# EAGLE design DAC (EAGLE 9.1.3)
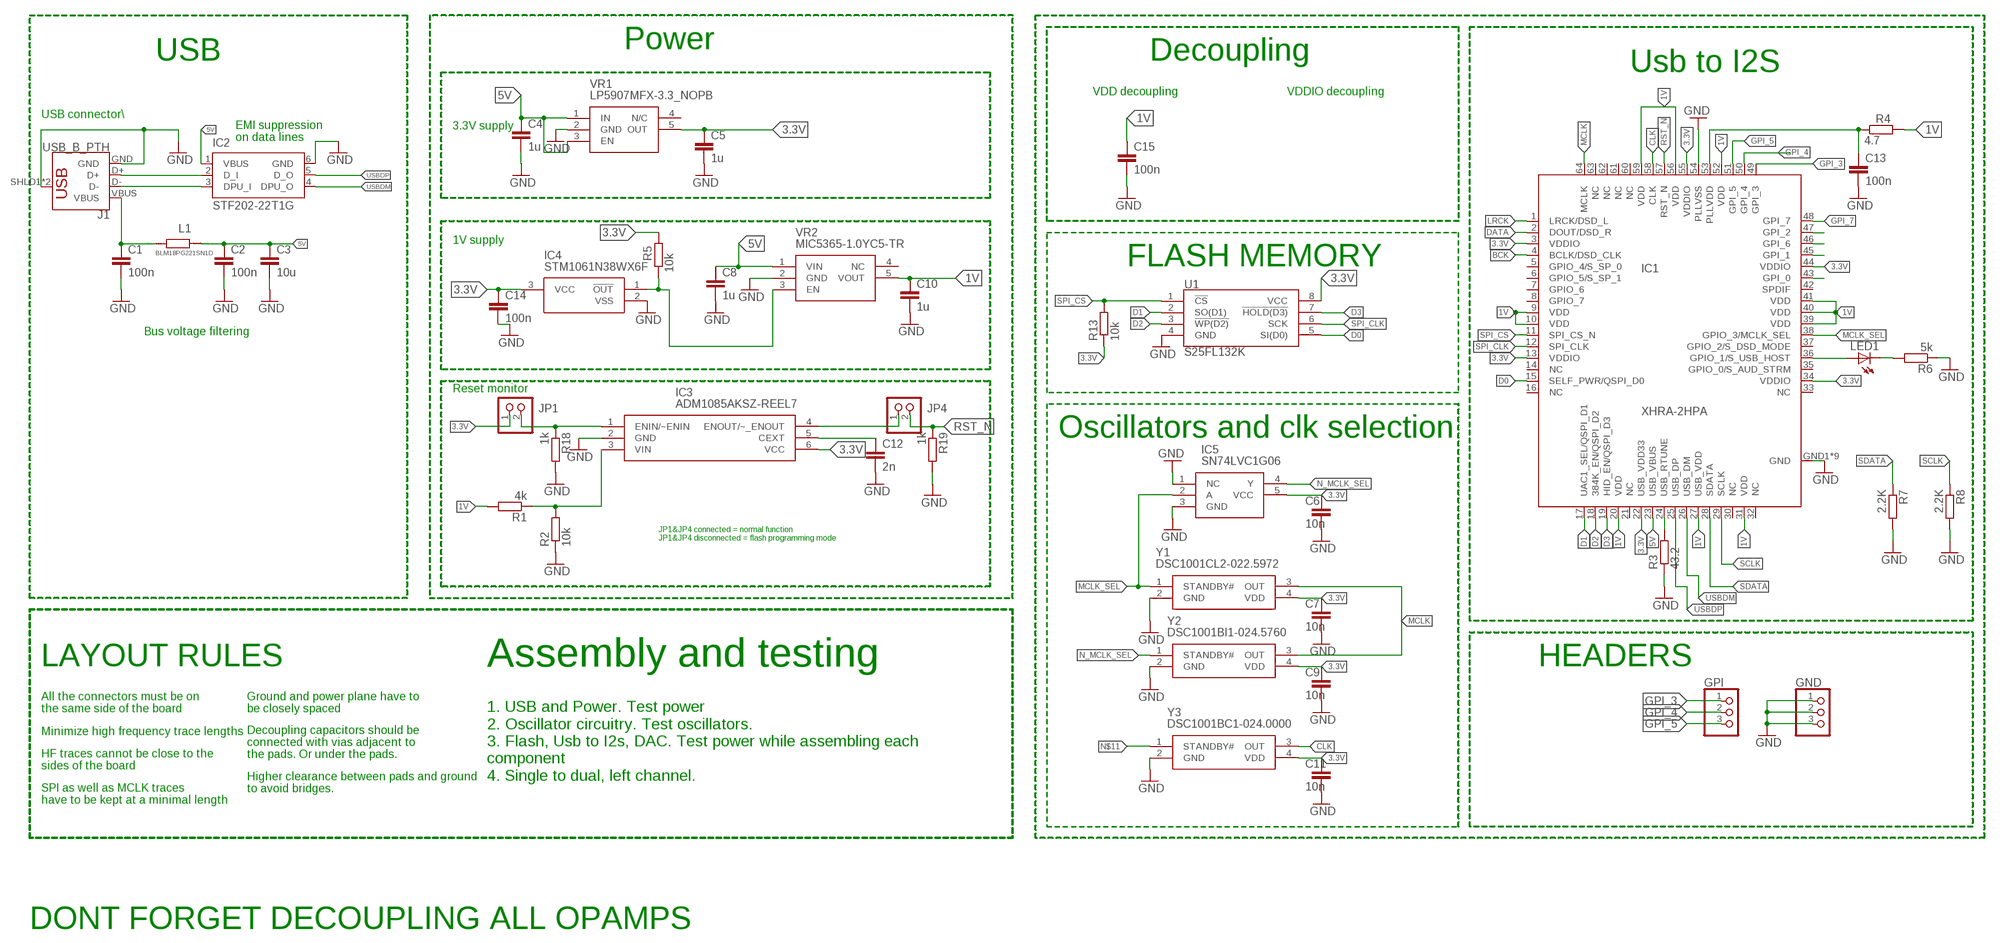
[diagram p0: schematic, sheet 1, part 1 of 2]
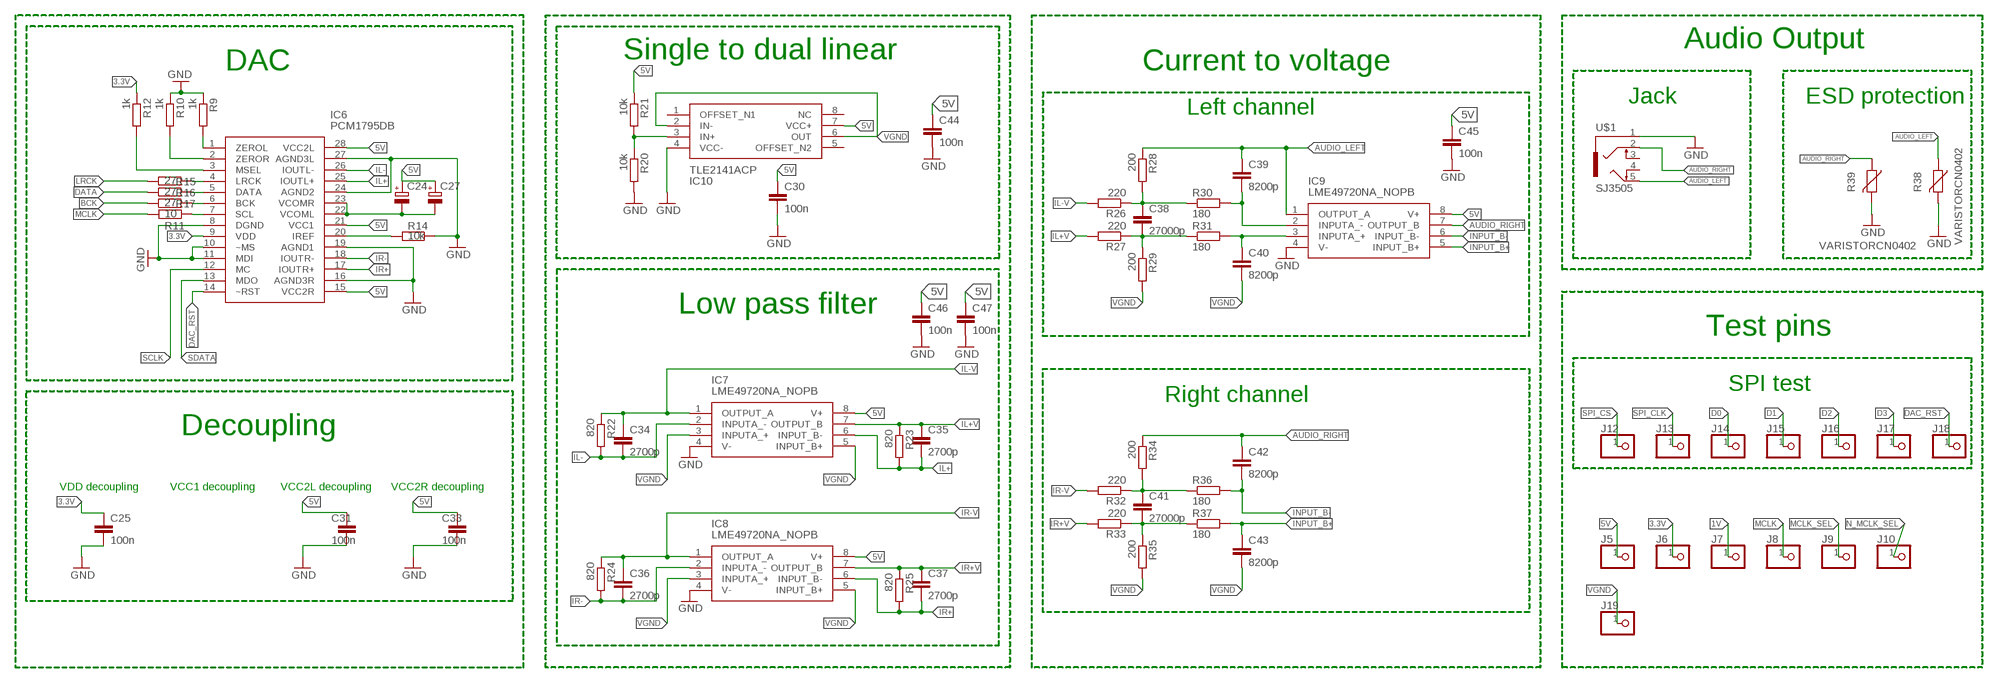
[diagram p1: schematic, sheet 1, part 2 of 2]

## Parts
C1  100n  C-EUC0603K  [C0603K]
C2  100n  C-EUC0603K  [C0603K]
C3  10u  C-EUC0603K  [C0603K]
C4  1u  C-EUC0603K  [C0603K]
C5  1u  C-EUC0603K  [C0603K]
C6  10n  C-EUC0603K  [C0603K]
C7  10n  C-EUC0603K  [C0603K]
C8  1u  C-EUC0603K  [C0603K]
C9  10n  C-EUC0603K  [C0603K]
C10  1u  C-EUC0603K  [C0603K]
C11  10n  C-EUC0603K  [C0603K]
C12  2n  C-EUC0603K  [C0603K]
C13  100n  C-EUC0603K  [C0603K]
C14  100n  C-EUC0603K  [C0603K]
C15  100n  C-EUC0603K  [C0603K]
C24  CPOL-EUSANYO_SMD_B6  [SANYO-OSCON_SMD_B6]
C25  100n  C-EUC0603K  [C0603K]
C27  CPOL-EUSANYO_SMD_B6  [SANYO-OSCON_SMD_B6]
C30  100n  C-EUC0603K  [C0603K]
C31  100n  C-EUC0603K  [C0603K]
C33  100n  C-EUC0603K  [C0603K]
C34  2700p  C-EUC0805  [C0805]
C35  2700p  C-EUC0805  [C0805]
C36  2700p  C-EUC0805  [C0805]
C37  2700p  C-EUC0805  [C0805]
C38  27000p  C-EUC1210  [C1210]
C39  8200p  C-EUC0805  [C0805]
C40  8200p  C-EUC0805  [C0805]
C41  27000p  C-EUC1210  [C1210]
C42  8200p  C-EUC0805  [C0805]
C43  8200p  C-EUC0805  [C0805]
C44  100n  C-EUC0603K  [C0603K]
C45  100n  C-EUC0603K  [C0603K]
C46  100n  C-EUC0603K  [C0603K]
C47  100n  C-EUC0603K  [C0603K]
GND  PINHD-1X3  [1X03]
GPI  PINHD-1X3  [1X03]
IC1  XHRA-2HPA  [TQFP64]
IC2  STF202-22T1G  [SOT23-6]
IC3  ADM1085AKSZ-REEL7  [SOT65P210X110-6N]
IC4  STM1061N38WX6F  [SOT103P237X112-3N]
IC5  SN74LVC1G06  SN74LVC1G17QDBVRQ1  [SOT95P280X145-5N]
IC6  PCM1795DB  [SOP65P780X200-28N]
IC7  LME49720NA_NOPB  [DIP794W53P254L959H508Q8N]
IC8  LME49720NA_NOPB  [DIP794W53P254L959H508Q8N]
IC9  LME49720NA_NOPB  [DIP794W53P254L959H508Q8N]
IC10  TLE2141ACP  [DIP794W53P254L959H508Q8N]
J1  USB_B_PTH  [USB-B-PTH]
J5  PINHD-1X1  [1X01]
J6  PINHD-1X1  [1X01]
J7  PINHD-1X1  [1X01]
J8  PINHD-1X1  [1X01]
J9  PINHD-1X1  [1X01]
J10  PINHD-1X1  [1X01]
J12  PINHD-1X1  [1X01]
J13  PINHD-1X1  [1X01]
J14  PINHD-1X1  [1X01]
J15  PINHD-1X1  [1X01]
J16  PINHD-1X1  [1X01]
J17  PINHD-1X1  [1X01]
J18  PINHD-1X1  [1X01]
J19  PINHD-1X1  [1X01]
JP1  PINHD-1X2  [1X02]
JP4  PINHD-1X2  [1X02]
L1  BLM18PG221SN1D  RR0603  [R0603]
LED1  LEDSML0603  [SML0603]
R1  4k  R-EU_R0603  [R0603]
R2  10k  R-EU_R0603  [R0603]
R3  43.2  R-EU_R0603  [R0603]
R4  4.7  R-EU_R0603  [R0603]
R5  10k  R-EU_R0603  [R0603]
R6  5k  R-EU_R0603  [R0603]
R7  2.2K  R-EU_R0603  [R0603]
R8  2.2K  R-EU_R0603  [R0603]
R9  1k  R-EU_R0603  [R0603]
R10  1k  R-EU_R0603  [R0603]
R11  10  R-EU_R0603  [R0603]
R12  1k  R-EU_R0603  [R0603]
R13  10k  R-EU_R0603  [R0603]
R14  10k  R-EU_R0603  [R0603]
R15  27  R-EU_R0603  [R0603]
R16  27  R-EU_R0603  [R0603]
R17  27  R-EU_R0603  [R0603]
R18  1k  R-EU_R0603  [R0603]
R19  1k  R-EU_R0603  [R0603]
R20  10k  R-EU_R0603  [R0603]
R21  10k  R-EU_R0603  [R0603]
R22  820  R-EU_R0603  [R0603]
R23  820  R-EU_R0603  [R0603]
R24  820  R-EU_R0603  [R0603]
R25  820  R-EU_R0603  [R0603]
R26  220  R-EU_R0603  [R0603]
R27  220  R-EU_R0603  [R0603]
R28  200  R-EU_R0603  [R0603]
R29  200  R-EU_R0603  [R0603]
R30  180  R-EU_R0603  [R0603]
R31  180  R-EU_R0603  [R0603]
R32  220  R-EU_R0603  [R0603]
R33  220  R-EU_R0603  [R0603]
R34  200  R-EU_R0603  [R0603]
R35  200  R-EU_R0603  [R0603]
R36  180  R-EU_R0603  [R0603]
R37  180  R-EU_R0603  [R0603]
R38  VARISTORCN0402  [CT/CN0402]
R39  VARISTORCN0402  [CT/CN0402]
U1  S25FL132K  AT25SF041  [SO08]
U$1  SJ3505  [SJ3505]
VR1  LP5907MFX-3.3_NOPB  [SOT95P280X145-5N]
VR2  MIC5365-1.0YC5-TR  MIC5365-1.8YC5-TR  [SOT65P210X110-5N]
Y1  DSC1001CL2-022.5972  DSC1001DL2-049.5000T  [DSC1001DL50250000T]
Y2  DSC1001BI1-024.5760  DSC1001DL2-049.5000T  [DSC1001DL50250000T]
Y3  DSC1001BC1-024.0000  DSC1001DL2-049.5000T  [DSC1001DL50250000T]

## Nets
1V: C10.1 C15.1 IC1.9(VDD) IC1.10(VDD) IC1.20(VDD) IC1.27(USB_VDD) IC1.31(VDD) IC1.39(VDD) IC1.40(VDD) IC1.41(VDD) IC1.52(VDD) IC1.56(VDD) IC1.59(VDD) J7.1 R1.2 R4.2 VR2.5(VOUT)
3.3V: C5.1 C6.1 C7.1 C9.1 C11.1 C14.1 C25.1 IC1.3(VDDIO) IC1.13(VDDIO) IC1.22(USB_VDD33) IC1.34(VDDIO) IC1.44(VDDIO) IC1.55(VDDIO) IC3.6(VCC) IC4.3(VCC) IC5.5(VCC) IC6.9(VDD) J6.1 JP1.1 R5.2 R12.1 R13.1 U1.8(VCC) VR1.5(OUT) Y1.4(VDD) Y2.4(VDD) Y3.4(VDD)
5V: C2.1 C3.1 C4.1 C8.1 C24.+ C27.+ C30.1 C31.1 C33.1 C44.1 C45.1 C46.1 C47.1 IC1.23(USB_VBUS) IC2.1(VBUS) IC6.15(VCC2R) IC6.21(VCC1) IC6.28(VCC2L) IC7.8(V+) IC8.8(V+) IC9.8(V+) IC10.7(VCC+) J5.1 L1.2 R21.1 VR1.1(IN) VR1.3(EN) VR2.1(VIN)
AUDIO_LEFT: C39.1 IC9.1(OUTPUT_A) R28.1 R38.1 U$1.5
AUDIO_RIGHT: C42.1 IC9.7(OUTPUT_B) R34.1 R39.1 U$1.2
BCK: IC1.4(BCLK/DSD_CLK) R17.1
CLK: IC1.58(CLK) Y3.3(OUT)
D0: IC1.15(SELF_PWR/QSPI_D0) J14.1 U1.5(SI(D0))
D1: IC1.17(UAC1_SEL/QSPI_D1) J15.1 U1.2(SO(D1))
D2: IC1.18(384K_EN/QSPI_D2) J16.1 U1.3(!WP(D2))
D3: IC1.19(HID_EN/QSPI_D3) J17.1 U1.7(!HOLD(D3))
DAC_RST: IC6.14(~RST) J18.1
DATA: IC1.2(DOUT/DSD_R) R16.1
DM_I: IC2.3(DPU_I) J1.D-
DP_I: IC2.2(D_I) J1.D+
GND: C1.2 C2.2 C3.2 C4.2 C5.2 C6.2 C7.2 C8.2 C9.2 C10.2 C11.2 C12.2 C13.2 C14.2 C15.2 C25.2 C30.2 C31.2 C33.2 C44.2 C45.2 C46.2 C47.2 GND.1 GND.2 GND.3 IC1.54(PLLVSS) IC1.GND1(GND) IC1.GND2(GND) IC1.GND3(GND) IC1.GND4(GND) IC1.GND5(GND) IC1.GND6(GND) IC1.GND7(GND) IC1.GND8(GND) IC1.GND9(GND) IC2.6(GND) IC3.2(GND) IC4.2(VSS) IC5.1(NC) IC5.3(GND) IC6.8(DGND) IC6.10(~MS) IC6.11(MDI) IC6.16(AGND3R) IC6.19(AGND1) IC6.24(AGND2) IC6.27(AGND3L) IC7.4(V-) IC8.4(V-) IC9.4(V-) IC10.4(VCC-) J1.GND J1.SHLD1(SHIELD) J1.SHLD2(SHIELD) R2.1 R3.1 R6.1 R7.2 R8.2 R9.1 R10.1 R14.1 R18.2 R19.2 R20.2 R38.2 R39.2 U1.4(GND) U$1.1 VR1.2(GND) VR2.2(GND) Y1.2(GND) Y2.2(GND) Y3.2(GND)
GPI_0: IC1.43(GPI_0)
GPI_1: IC1.45(GPI_1)
GPI_2: IC1.47(GPI_2)
GPI_3: GPI.1 IC1.49(GPI_3)
GPI_4: GPI.2 IC1.50(GPI_4)
GPI_5: GPI.3 IC1.51(GPI_5)
GPI_6: IC1.46(GPI_6)
GPI_7: IC1.48(GPI_7)
IL+: C35.2 IC6.25(IOUTL+) IC7.6(INPUT_B-) R23.2
IL+V: C35.1 IC7.7(OUTPUT_B) R23.1 R27.2
IL-: C34.2 IC6.26(IOUTL-) IC7.2(INPUTA_-) R22.2
IL-V: C34.1 IC7.1(OUTPUT_A) R22.1 R26.2
INPUT_B+: C43.1 IC9.5(INPUT_B+) R37.2
INPUT_B-: C42.2 IC9.6(INPUT_B-) R36.2
IR+: C37.2 IC6.17(IOUTR+) IC8.6(INPUT_B-) R25.2
IR+V: C37.1 IC8.7(OUTPUT_B) R25.1 R33.2
IR-: C36.2 IC6.18(IOUTR-) IC8.2(INPUTA_-) R24.2
IR-V: C36.1 IC8.1(OUTPUT_A) R24.1 R32.2
LRCK: IC1.1(LRCK/DSD_L) R15.1
MCLK: IC1.64(MCLK) J8.1 R11.2 Y1.3(OUT) Y2.3(OUT)
MCLK_SEL: IC1.38(GPIO_3/MCLK_SEL) IC5.2(A) J9.1 Y1.1(STANDBY#)
N$2: C1.1 J1.VBUS L1.1
N$4: C12.1 IC3.5(CEXT)
N$5: IC3.3(VIN) R1.1 R2.2
N$6: IC1.24(USB_RTUNE) R3.2
N$7: C13.1 IC1.53(PLLVDD) R4.1
N$8: IC4.1(!OUT) R5.1 VR2.3(EN)
N$11: Y3.1(STANDBY#)
N$13: IC1.36(GPIO_1/S_USB_HOST) LED1.A
N$14: LED1.C R6.2
N$16: IC6.1(ZEROL) R9.2
N$18: IC6.7(SCL) R11.1
N$19: IC6.2(ZEROR) R10.2
N$20: IC6.3(MSEL) R12.2
N$21: IC6.20(IREF) R14.2
N$22: IC6.4(LRCK) R15.2
N$23: IC6.6(BCK) R17.2
N$24: IC6.5(DATA) R16.2
N$25: IC3.1(ENIN/~ENIN) JP1.2 R18.1
N$29: IC3.4(ENOUT/~_ENOUT) JP4.1
N$30: C24.- C27.- IC6.22(VCOML) IC6.23(VCOMR)
N$35: IC10.3(IN+) R20.1 R21.2
N$39: C38.1 R26.1 R28.2 R30.1
N$40: C38.2 R27.1 R29.1 R31.1
N$41: C40.1 IC9.3(INPUTA_+) R31.2
N$42: C39.2 IC9.2(INPUTA_-) R30.2
N$45: C41.1 R32.1 R34.2 R36.1
N$46: C41.2 R33.1 R35.1 R37.1
N_MCLK_SEL: IC5.4(Y) J10.1 Y2.1(STANDBY#)
RST_N: IC1.57(RST_N) JP4.2 R19.1
SCLK: IC1.29(SCLK) IC6.12(MC) R8.1
SDATA: IC1.28(SDATA) IC6.13(MDO) R7.1
SPI_CLK: IC1.12(SPI_CLK) J13.1 U1.6(SCK)
SPI_CS: IC1.11(SPI_CS_N) J12.1 R13.2 U1.1(!CS)
USBDM: IC1.26(USB_DM) IC2.4(DPU_O)
USBDP: IC1.25(USB_DP) IC2.5(D_O)
VGND: C40.2 C43.2 IC7.3(INPUTA_+) IC7.5(INPUT_B+) IC8.3(INPUTA_+) IC8.5(INPUT_B+) IC10.2(IN-) IC10.6(OUT) J19.1 R29.2 R35.2
Unconnected: IC1.5(GPIO_4/S_SP_0) IC1.6(GPIO_5/S_SP_1) IC1.7(GPIO_6) IC1.8(GPIO_7) IC1.14(NC) IC1.16(NC) IC1.21(NC) IC1.30(NC) IC1.32(NC) IC1.33(NC) IC1.35(GPIO_0/S_AUD_STRM) IC1.37(GPIO_2/S_DSD_MODE) IC1.42(SPDIF) IC1.60(NC) IC1.61(NC) IC1.62(NC) IC1.63(NC) IC10.1(OFFSET_N1) IC10.5(OFFSET_N2) IC10.8(NC) U$1.3 U$1.4 VR1.4(N/C) VR2.4(NC)

## Notes on the sheet
- Power | Audio Output
- USB | Decoupling | Single to dual linear
- Usb to I2S | DAC | Current to voltage
- VDD decoupling | VDDIO decoupling
- Jack | ESD protection
- USB connector\ | Left channel
- 3.3V supply
- EMI suppression
  on data lines
- 1V supply
- FLASH MEMORY
- Low pass filter
- Bus voltage filtering
- Test pins
- Reset monitor
- SPI test
- Right channel
- Oscillators and clk selection
- Decoupling
- VDD decoupling | VCC1 decoupling | VCC2L decoupling | VCC2R decoupling
- JP1&JP4 connected = normal function
  JP1&JP4 disconnected = flash programming mode
- LAYOUT RULES | Assembly and testing | HEADERS
- All the connectors must be on 
  the same side of the board
- Ground and power plane have to
  be closely spaced
- Minimize high frequency trace lengths
- Decoupling capacitors should be
  connected with vias adjacent to 
  the pads. Or under the pads.
- HF traces cannot be close to the
  sides of the board
- 1. USB and Power. Test power
  2. Oscillator circuitry. Test oscillators.
  3. Flash, Usb to I2s, DAC. Test power while assembling each
  component
  4. Single to dual, left channel.
- Higher clearance between pads and ground
  to avoid bridges.
- SPI as well as MCLK traces
  have to be kept at a minimal length
- DONT FORGET DECOUPLING ALL OPAMPS

## Library data of the parts
C1 C2 C13-C15 C25 C30 C31 C33 C44-C47 = resistor:C-EU: CAPACITOR, European symbol; MPN: A104M15X7RF5TAA; OC_NEWARK: 74AC7050
C3-C12 = resistor:C-EU: CAPACITOR, European symbol; OC_NEWARK: unknown
C24 C27 = rcl:CPOL-EU: POLARIZED CAPACITOR, European symbol; OC_NEWARK: unknown; SPICEPREFIX: C
C34-C43 = rcl:C-EU: CAPACITOR, European symbol; SPICEPREFIX: C
GND GPI = pinhead:PINHD-1X3: PIN HEADER
IC1 = pavouk:XHRA-2HPA: XHRA-2HPA xCORE-AUDIO Processor; OC_NEWARK: unknown
IC2 = stf202_10:STF202-22T1G: USB Filter with ESD Protection Source: http://www.onsemi.com/pub_link/Collateral/STF202-22T1-D.PDF; MF: ON SEMICONDUCTOR; MPN: STF202-22T1G; OC_FARNELL: 1651958; OC_NEWARK: 45J2271
IC3 = ADM1085AKSZ-REEL7:ADM1085AKSZ-REEL7: Analog Devices ADM1085AKSZ-REEL7, Voltage Supervisor, 0.6 22 V, 6-Pin SC-70 Source: Datasheet; ARROW_PART_NUMBER: ADM1085AKSZ-REEL7; ARROW_PRICE/STOCK: https://www.arrow.com/en/products/adm1085aksz-reel7/analog-devices; DESCRIPTION: Analog Devices ADM1085AKSZ-REEL7, Voltage Supervisor, 0.6 22 V, 6-Pin SC-70; HEIGHT: mm; MANUFACTURER_NAME: Analog Devices; MANUFACTURER_PART_NUMBER: ADM1085AKSZ-REEL7; OC_NEWARK: unknown; RS_PART_NUMBER: 7427705P; RS_PRICE/STOCK: http://uk.rs-online.com/web/p/products/7427705P
IC4 = STM1061N38WX6F:STM1061N38WX6F: STM1061N38WX6F, Voltage Detector 3.724V Low Power Voltage Detector 3-Pin SOT-23 Source: Datasheet; ALLIED_NUMBER: 70390901; ALLIED_PRICE/STOCK: http://www.alliedelec.com/stmicroelectronics-stm1061n38wx6f/70390901/; ARROW_PART_NUMBER: STM1061N38WX6F; ARROW_PRICE/STOCK: https://www.arrow.com/en/products/stm1061n38wx6f/stmicroelectronics; DESCRIPTION: STM1061N38WX6F, Voltage Detector 3.724V Low Power Voltage Detector 3-Pin SOT-23; HEIGHT: 1.12mm; MANUFACTURER_NAME: STMicroelectronics; MANUFACTURER_PART_NUMBER: STM1061N38WX6F; OC_NEWARK: unknown; RS_PART_NUMBER: 6864800; RS_PRICE/STOCK: http://uk.rs-online.com/web/p/voltage-supervisors/6864800/?source=DS
IC5 = SN74LVC1G17QDBVRQ1:SN74LVC1G17QDBVRQ1: Automotive Catalog Single Schmitt-Trigger Buffer Source: Datasheet; ARROW_PART_NUMBER: SN74LVC1G17QDBVRQ1; ARROW_PRICE/STOCK: https://www.arrow.com/en/products/sn74lvc1g17qdbvrq1/texas-instruments; DESCRIPTION: Automotive Catalog Single Schmitt-Trigger Buffer; HEIGHT: 1.45mm; MANUFACTURER_NAME: Texas Instruments; MANUFACTURER_PART_NUMBER: SN74LVC1G17QDBVRQ1; OC_NEWARK: unknown
IC6 = PCM1795DB:PCM1795DB: 32-Bit, 192-kHz Sampling, Advanced Segment Stereo Audio Digital-to-Analog Converter Source: Datasheet; ARROW_PART_NUMBER: PCM1795DB; ARROW_PRICE-STOCK: https://www.arrow.com/en/products/pcm1795db/texas-instruments; DESCRIPTION: 32-Bit, 192-kHz Sampling, Advanced Segment Stereo Audio Digital-to-Analog Converter; HEIGHT: mm; MANUFACTURER_NAME: Texas Instruments; MANUFACTURER_PART_NUMBER: PCM1795DB; OC_NEWARK: unknown; RS_PART_NUMBER: 8143710P; RS_PRICE-STOCK: http://uk.rs-online.com/web/p/products/8143710P
IC7-IC9 = LME49720NA_NOPB:LME49720NA_NOPB: OP Amp Dual GP 17V PDIP8 Texas Instruments LME49720NA/NOPB, Dual Audio Op Amp, 55MHz Rail-Rail, 8-Pin PDIP Source: Datasheet; ARROW_PART_NUMBER: LME49720NA/NOPB; ARROW_PRICE-STOCK: https://www.arrow.com/en/products/lme49720nanopb/texas-instruments; DESCRIPTION: OP Amp Dual GP 17V PDIP8 Texas Instruments LME49720NA/NOPB, Dual Audio Op Amp, 55MHz Rail-Rail, 8-Pin PDIP; HEIGHT: 5.08mm; MANUFACTURER_NAME: Texas Instruments; MANUFACTURER_PART_NUMBER: LME49720NA/NOPB; OC_NEWARK: unknown; RS_PART_NUMBER: 7616217P; RS_PRICE-STOCK: http://uk.rs-online.com/web/p/products/7616217P
IC10 = TLE2141ACP:TLE2141ACP: Excalibur Low-Noise High-Speed Precision Operational Amplifier Source: Datasheet; ARROW_PART_NUMBER: TLE2141ACP; ARROW_PRICE-STOCK: https://www.arrow.com/en/products/tle2141acp/texas-instruments; DESCRIPTION: Excalibur Low-Noise High-Speed Precision Operational Amplifier; HEIGHT: 5.08mm; MANUFACTURER_NAME: Texas Instruments; MANUFACTURER_PART_NUMBER: TLE2141ACP; OC_NEWARK: unknown; RS_PART_NUMBER: 6612003P; RS_PRICE-STOCK: http://uk.rs-online.com/web/p/products/6612003P
J1 = SparkFun-Connectors:USB_B: USB Type B Connector SparkFun Products: SparkFun Stepoko <https://www.sparkfun.com/products/13899> PTH; OC_NEWARK: unknown; PROD_ID: CONN-08278; SF_ID: PRT-00139
J5-J10 J12-J19 = pinhead:PINHD-1X1: PIN HEADER
JP1 JP4 = pinhead:PINHD-1X2: PIN HEADER; OC_NEWARK: unknown
L1 = eagle-ltspice:R: RESISTOR, European symbol; OC_NEWARK: unknown; SPICEMODEL: NONE; SPICEPREFIX: R
LED1 = led:LED: LED OSRAM: - CHIPLED LG R971, LG N971, LY N971, LG Q971, LY Q971, LO R971, LY R971 LH N974, LH R974 LS Q976, LO Q976, LY Q976 LO Q996 - Hyper CHIPLED LW Q18S LB Q993, LB Q99A, LB R99A - SideLED LS A670, LO A670, LY A670, LG A670, LP A670 LB A673, LV A673, LT A673, LW A673 LH A674 LY A675 LS A676, LA A676, LO A676, LY A676, LW A676 LS A679, LY A679, LG A679 - Hyper Micro SIDELED® LS Y876, LA Y876, LO Y876, LY Y876 LT Y87S - SmartLED LW L88C, LW L88S LB L89C, LB L89S, LG L890 LS L89K, LO L89K, LY L89K LS L896, LA L896, LO L896, LY L896 - TOPLED LS T670, LO T670, LY T670, LG T670, LP T670 LSG T670, LSP T670, LSY T670, LOP T670, LYG T670 LG T671, LOG T671, LSG T671 LB T673, LV T673, LT T673, LW T673 LH T674 LS T676, LA T676, LO T676, LY T676, LB T676, LH T676, LSB T676, LW T676 LB T67C, LV T67C, LT T67C, LS T67K, LO T67K, LY T67K, LW E67C LS E67B, LA E67B, LO E67B, LY E67B, LB E67C, LV E67C, LT E67C LW T67C LS T679, LY T679, LG T679 LS T770, LO T770, LY T770, LG T770, LP T770 LB T773, LV T773, LT T773, LW T773 LH T774 LS E675, LA E675, LY E675, LS T675 LS T776, LA T776, LO T776, LY T776, LB T776 LHGB T686 LT T68C, LB T68C - Hyper Mini TOPLED® LB M676 - Mini TOPLED Santana® LG M470 LS M47K, LO M47K, LY M47K Source: http://www.osram.convergy.de LUXEON: - LUMILED® LXK2-PW12-R00, LXK2-PW12-S00, LXK2-PW14-U00, LXK2-PW14-V00 LXK2-PM12-R00, LXK2-PM12-S00, LXK2-PM14-U00 LXK2-PE12-Q00, LXK2-PE12-R00, LXK2-PE12-S00, LXK2-PE14-T00, LXK2-PE14-U00 LXK2-PB12-K00, LXK2-PB12-L00, LXK2-PB12-M00, LXK2-PB14-N00, LXK2-PB14-P00, LXK2-PB14-Q00 LXK2-PR12-L00, LXK2-PR12-M00, LXK2-PR14-Q00, LXK2-PR14-R00 LXK2-PD12-Q00, LXK2-PD12-R00, LXK2-PD12-S00 LXK2-PH12-R00, LXK2-PH12-S00 LXK2-PL12-P00, LXK2-PL12-Q00, LXK2-PL12-R00 Source: www.luxeon.com KINGBRIGHT: KA-3528ASYC Source: www.kingbright.com; OC_NEWARK: unknown
R1-R37 = resistor:R-EU_: RESISTOR, European symbol; OC_NEWARK: unknown
R38 R39 = varistor:VARISTOR: VARISTOR
U1 = SparkFun-IC-Memory:AT25SF041: AT25SF041 4Mb Serial Flash Memory 104MHz, SPI, 8-SOIC Datasheet <http://www.adestotech.com/wp-content/uploads/DS-AT25SF041_044.pdf> SparkFun Products: SparkFun ESP8266 Thing <https://www.sparkfun.com/products/13231> SparkFun ESP8266 Thing - Dev Board <https://www.sparkfun.com/products/13711>; OC_NEWARK: unknown; PROD_ID: IC-12455; VALUE: 4MB Flash
U$1 = bardiir:SJ3505
VR1 = LP5907MFX-3.3_NOPB:LP5907MFX-3.3_NOPB: TEXAS INSTRUMENTS - LP5907MFX-3.3/NOPB - LDO, FIXED, 3.3V, 0.25A, SOT-23-5 Source: Datasheet; ARROW_PART_NUMBER: LP5907MFX-3.3/NOPB; ARROW_PRICE/STOCK: https://www.arrow.com/en/products/lp5907mfx-3.3nopb/texas-instruments; DESCRIPTION: TEXAS INSTRUMENTS - LP5907MFX-3.3/NOPB - LDO, FIXED, 3.3V, 0.25A, SOT-23-5; HEIGHT: 1.45mm; MANUFACTURER_NAME: Texas Instruments; MANUFACTURER_PART_NUMBER: LP5907MFX-3.3/NOPB; OC_NEWARK: unknown
VR2 = MIC5365-1.8YC5-TR:MIC5365-1.8YC5-TR: IC REG LINEAR 1.8V 150MA SC70-5 Source: Datasheet; ARROW_PART_NUMBER: MIC5365-1.8YC5-TR; ARROW_PRICE/STOCK: http://uk.rs-online.com/web/p/products/1655152; DESCRIPTION: IC REG LINEAR 1.8V 150MA SC70-5; HEIGHT: 1.1mm; MANUFACTURER_NAME: Microchip; MANUFACTURER_PART_NUMBER: MIC5365-1.8YC5-TR; OC_NEWARK: unknown; RS_PART_NUMBER: 1655152; RS_PRICE/STOCK: http://uk.rs-online.com/web/p/products/1655152
Y1-Y3 = DSC1001DL2-049.5000T:DSC1001DL2-049.5000T: Standard Clock Oscillators Oscillator Low Power -40C-105C 25ppm Source: Datasheet; ARROW_PART_NUMBER: DSC1001DL2-049.5000T; DESCRIPTION: Standard Clock Oscillators Oscillator Low Power -40C-105C 25ppm; HEIGHT: 0mm; MANUFACTURER_NAME: Microchip; MANUFACTURER_PART_NUMBER: DSC1001DL2-049.5000T; OC_NEWARK: unknown

## Board
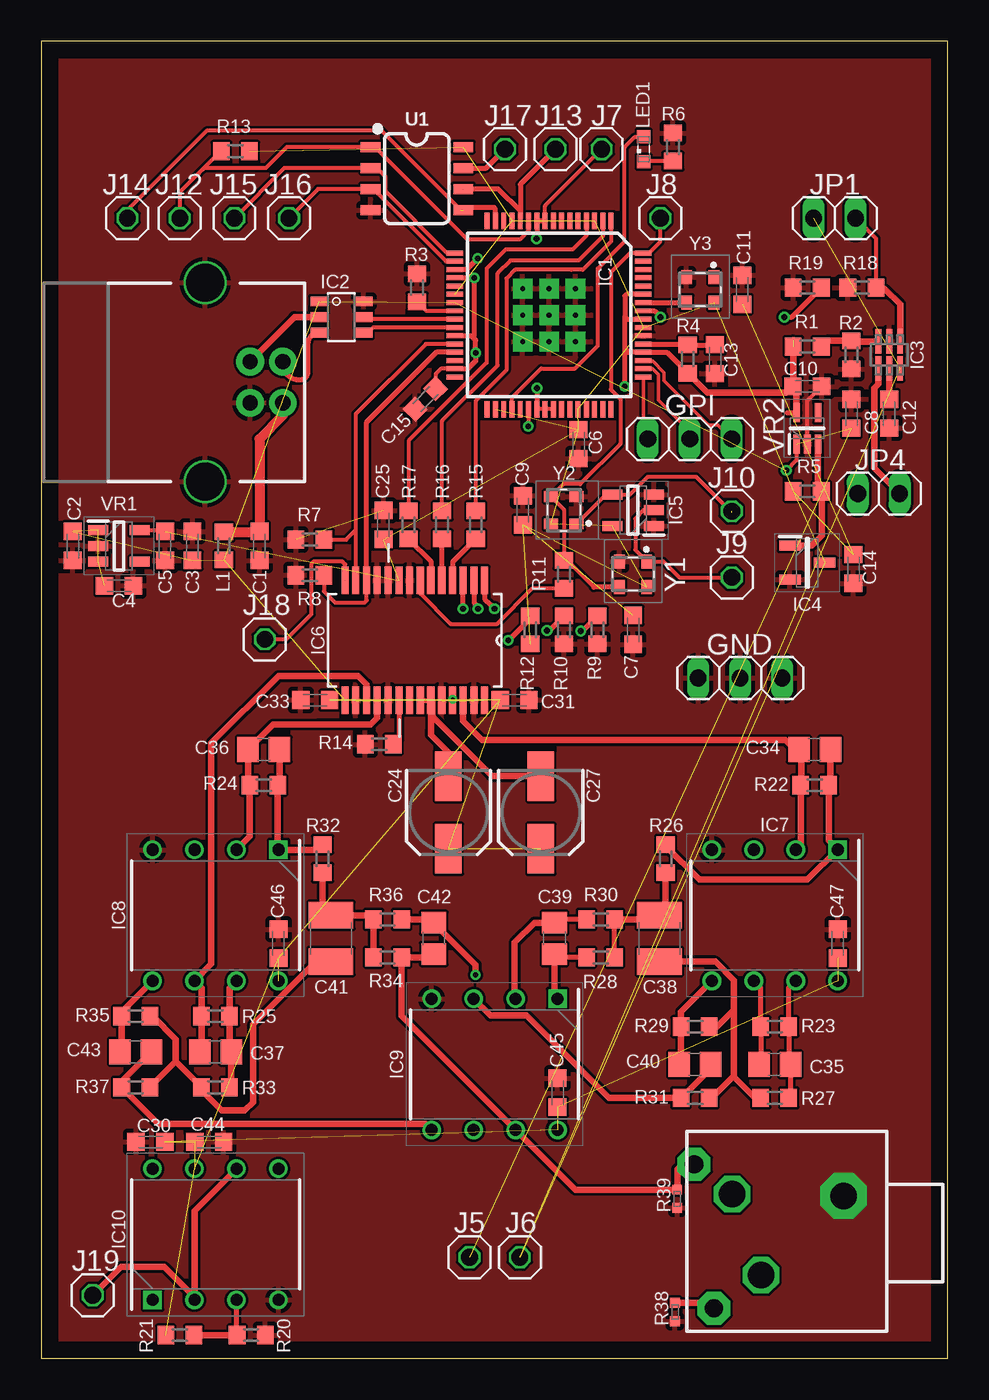
[diagram p2: board, top side]
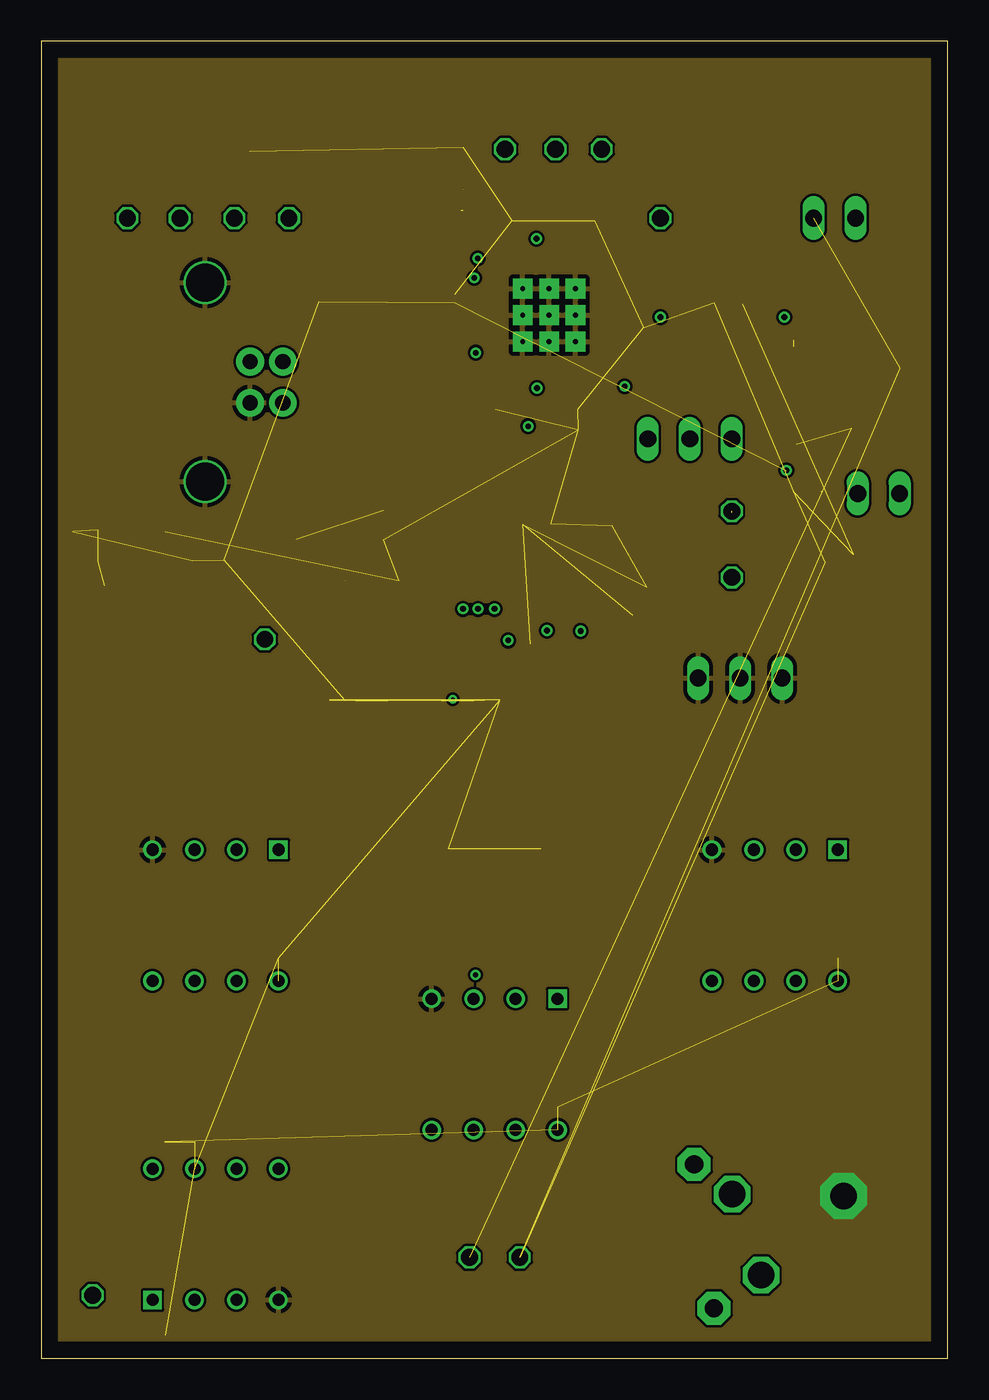
[diagram p3: board, inner layer Route2]
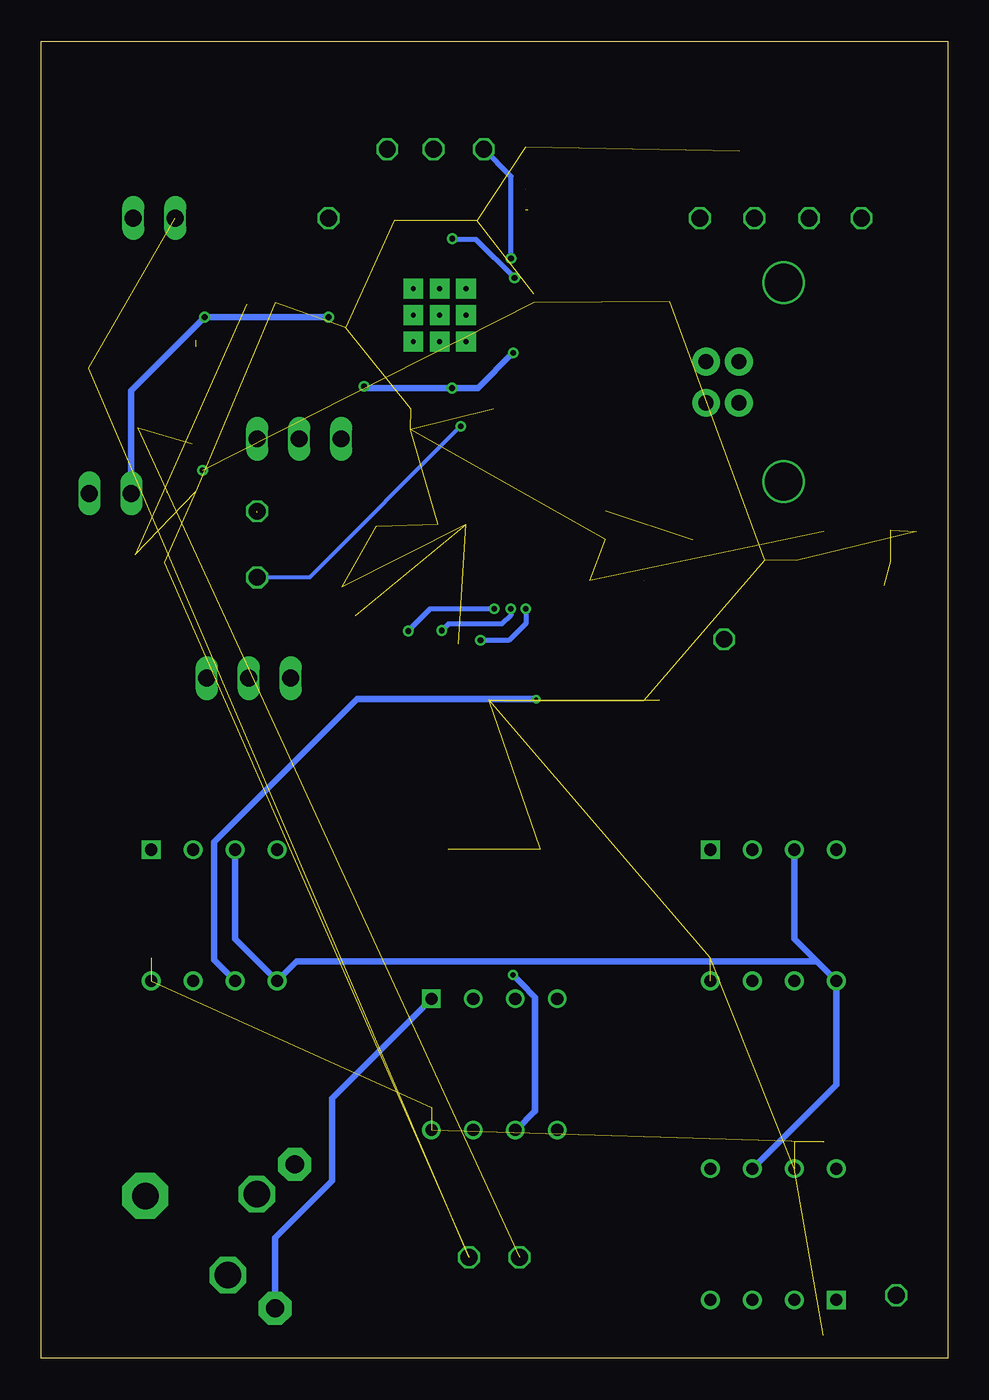
[diagram p4: board, bottom side, seen from below]

Size 54.84 x 79.68 mm. Coordinates in mm from the lower left corner, seen from the top.
Outline: 0,0 54.84,0 54.84,79.68 0,79.68 0,0
Copper layers (1+2*15+16): Top 0.035mm / dielectric 1.5mm / Route2 0.035mm / dielectric 0.15mm / Route15 0.035mm / dielectric 0.2mm / Bottom 0.035mm
Design rules "default *": minimum track width 6mil, minimum drill 0.2mm, track to track 6mil, track to pad 6mil, pad to pad 6mil, via to via 6mil, smd to smd 6mil, copper to edge 40mil, drill to drill 6mil, minimum pad ring 6mil, minimum via ring 6mil, stop-mask expansion 4mil, vias tented up to drill 0mil, thermal gap 10mil

### Footprints (pad centres in the part's own frame; a part is rotated, then mirrored left to right if it is on the bottom)
C0603K = smd 1.05 x 1.08: 1 -0.875,0; 2 0.875,0
SANYO-OSCON_SMD_B6 = smd 3 x 1.6: + 2.2,0; - -2.2,0
C0805 = smd 1.3 x 1.5: 1 -0.95,0; 2 0.95,0
C1210 = smd 1.6 x 2.7: 1 -1.4,0; 2 1.4,0
1X03 = drill 1.016 long: 1 -2.54,0; 2 0,0; 3 2.54,0
TQFP64 = smd 1 x 0.3: 1 -5.7,3.75; 2 -5.7,3.25; 3 -5.7,2.75; 4 -5.7,2.25; 5 -5.7,1.75; 6 -5.7,1.25; 7 -5.7,0.75; 8 -5.7,0.25; 9 -5.7,-0.25; 10 -5.7,-0.75; 11 -5.7,-1.25; 12 -5.7,-1.75; 13 -5.7,-2.25; 14 -5.7,-2.75; 15 -5.7,-3.25; 16 -5.7,-3.75; 33 5.7,-3.75; 34 5.7,-3.25; 35 5.7,-2.75; 36 5.7,-2.25; 37 5.7,-1.75; 38 5.7,-1.25; 39 5.7,-0.75; 40 5.7,-0.25; 41 5.7,0.25; 42 5.7,0.75; 43 5.7,1.25; 44 5.7,1.75; 45 5.7,2.25; 46 5.7,2.75; 47 5.7,3.25; 48 5.7,3.75 | smd 0.3 x 1: 17 -3.75,-5.7; 18 -3.25,-5.7; 19 -2.75,-5.7; 20 -2.25,-5.7; 21 -1.75,-5.7; 22 -1.25,-5.7; 23 -0.75,-5.7; 24 -0.25,-5.7; 25 0.25,-5.7; 26 0.75,-5.7; 27 1.25,-5.7; 28 1.75,-5.7; 29 2.25,-5.7; 30 2.75,-5.7; 31 3.25,-5.7; 32 3.75,-5.7; 49 3.75,5.7; 50 3.25,5.7; 51 2.75,5.7; 52 2.25,5.7; 53 1.75,5.7; 54 1.25,5.7; 55 0.75,5.7; 56 0.25,5.7; 57 -0.25,5.7; 58 -0.75,5.7; 59 -1.25,5.7; 60 -1.75,5.7; 61 -2.25,5.7; 62 -2.75,5.7; 63 -3.25,5.7; 64 -3.75,5.7 | drill 0.3 pad 1.2 square: GND1 -1.6,1.6; GND2 0,1.6; GND3 1.6,1.6; GND4 1.6,0; GND5 1.6,-1.6; GND6 0,-1.6; GND7 -1.6,-1.6; GND8 -1.6,0; GND9 0,0
SOT23-6 = smd 0.6 x 1.05: 1 -0.95,-1.35; 2 0,-1.35; 3 0.95,-1.35; 4 0.95,1.35; 5 0,1.35; 6 -0.95,1.35
SOT65P210X110-6N = smd 1.473 x 0.356: 1 -0.813,0.66; 2 -0.813,0; 3 -0.813,-0.66; 4 0.813,-0.66; 5 0.813,0; 6 0.813,0.66
SOT103P237X112-3N = smd 1.3 x 0.6: 1 -1.05,1.03; 2 -1.05,-1.03; 3 1.05,0
SOT95P280X145-5N = smd 1.2 x 0.6: 1 -1.25,0.95; 2 -1.25,0; 3 -1.25,-0.95; 4 1.25,-0.95; 5 1.25,0.95
SOP65P780X200-28N = smd 1.651 x 0.432: 1 -3.632,4.216; 2 -3.632,3.581; 3 -3.632,2.921; 4 -3.632,2.286; 5 -3.632,1.626; 6 -3.632,0.965; 7 -3.632,0.33; 8 -3.632,-0.33; 9 -3.632,-0.965; 10 -3.632,-1.626; 11 -3.632,-2.286; 12 -3.632,-2.921; 13 -3.632,-3.581; 14 -3.632,-4.216; 15 3.632,-4.216; 16 3.632,-3.581; 17 3.632,-2.921; 18 3.632,-2.286; 19 3.632,-1.626; 20 3.632,-0.965; 21 3.632,-0.33; 22 3.632,0.33; 23 3.632,0.965; 24 3.632,1.626; 25 3.632,2.286; 26 3.632,2.921; 27 3.632,3.581; 28 3.632,4.216
DIP794W53P254L959H508Q8N = drill 0.73 pad 1.13 square: 1 -3.97,3.81 | drill 0.73 pad 1.13: 2 -3.97,1.27; 3 -3.97,-1.27; 4 -3.97,-3.81; 5 3.97,-3.81; 6 3.97,-1.27; 7 3.97,1.27; 8 3.97,3.81
USB-B-PTH = drill 0.914 pad 1.676: D+ 4,1.25; D- 5.981,1.25; GND 4,-1.25; VBUS 5.981,-1.25 | drill 2.286: SHLD1 1.282,-6.02; SHLD2 1.282,6.02
1X01 = drill 1.016 octagon: 1 0,0
1X02 = drill 1.016 long: 1 -1.27,0; 2 1.27,0
R0603 = smd 1 x 1.1: 1 -0.85,0; 2 0.85,0
SML0603 = smd 0.8 x 0.8: A 0.75,0; C -0.75,0
CT/CN0402 = smd 0.6 x 0.6: 1 -0.55,0; 2 0.55,0
SO08 = smd 0.6 x 1.2: 1 -1.905,-2.8; 2 -0.635,-2.8; 3 0.635,-2.8; 4 1.905,-2.8; 5 1.905,2.8; 6 0.635,2.8; 7 -0.635,2.8; 8 -1.905,2.8
SJ3505 = drill 1.6 pad 2.8 octagon: 1 2.5,-2.2 | drill 1.1 pad 2 octagon: 2 11.55,-4.1; 5 10.35,4.6 | drill 1.6 pad 2.2 octagon: 3 9.25,-2.3; 4 7.5,2.6
SOT65P210X110-5N = smd 1.15 x 0.4: 1 -0.95,0.65; 2 -0.95,0; 3 -0.95,-0.65; 4 0.95,-0.65; 5 0.95,0.65
DSC1001DL50250000T = smd 0.85 x 0.65: 1 -0.775,0.825; 2 -0.775,-0.825; 3 0.775,-0.825; 4 0.775,0.825

### Placement (x,y rotation side)
C1  13.21,49.15 270 top
C2  1.91,49.15 270 top
C3  9.14,49.15 90 top
C4  4.7,46.74 0 top
C5  7.49,49.15 270 top
C6  32.51,55.31 270 top
C7  35.81,44.07 270 top
C8  49.02,57.15 90 top
C9  29.15,51.31 90 top
C10  46.35,58.8 0 top
C11  42.42,64.64 90 top
C12  51.31,57.15 270 top
C13  40.77,60.45 270 top
C14  49.15,47.75 270 top
C15  23.24,58.04 225 top
C24  24.64,33.02 270 top
C25  20.7,50.42 90 top
C27  30.23,33.02 270 top
C30  6.6,13.08 180 top
C31  28.64,39.81 0 top
C33  16.57,39.81 180 top
C34  46.8,36.83 180 top
C35  44.39,17.78 180 top
C36  13.46,36.83 180 top
C37  10.54,18.54 180 top
C38  37.4,25.4 270 top
C39  31.05,25.4 90 top
C40  39.56,17.78 180 top
C41  17.53,25.4 270 top
C42  23.75,25.4 90 top
C43  5.71,18.54 180 top
C44  10.16,13.08 0 top
C45  31.24,16.07 90 top
C46  14.35,25.08 90 top
C47  48.2,25.08 90 top
GND  42.29,41.15 0 top
GPI  39.24,55.63 0 top
IC1  30.73,63.12 270 top
IC2  18.16,62.99 270 top
IC3  51.31,60.71 270 top
IC4  46.35,48.13 0 top
IC5  35.81,51.31 180 top
IC6  22.61,43.43 270 top
IC7  44.39,26.8 270 top
IC8  10.54,26.8 270 top
IC9  27.43,17.78 270 top
IC10  10.54,7.49 90 top
J1  8.64,59.05 0 top
J5  25.91,6.1 0 top
J6  28.96,6.1 0 top
J7  33.91,73.15 0 top
J8  37.47,68.99 0 top
J9  41.78,47.24 180 top
J10  41.78,51.24 0 top
J12  8.38,68.99 90 top
J13  31.11,73.15 0 top
J14  5.21,68.99 0 top
J15  11.68,68.99 90 top
J16  14.99,68.99 90 top
J17  28.07,73.15 0 top
J18  13.53,43.5 180 top
J19  3.11,3.81 0 top
JP1  48.01,68.99 0 top
JP4  50.67,52.32 180 top
L1  11.05,49.15 270 top
LED1  36.45,73.15 90 top
R1  46.35,61.21 180 top
R2  49.02,60.71 90 top
R3  22.73,64.77 270 top
R4  39.12,60.45 270 top
R5  46.35,52.45 180 top
R6  38.23,73.28 270 top
R7  16.26,49.53 180 top
R8  16.26,47.37 180 top
R9  33.66,44.07 90 top
R10  31.62,44.07 90 top
R11  31.62,47.43 90 top
R12  29.59,44.07 90 top
R13  11.75,73.03 180 top
R14  20.45,37.15 0 top
R15  26.29,50.42 270 top
R16  24.26,50.42 270 top
R17  22.23,50.42 270 top
R18  49.66,64.77 180 top
R19  46.35,64.77 180 top
R20  12.7,1.4 0 top
R21  8.38,1.4 0 top
R22  46.8,34.67 180 top
R23  44.39,20.07 180 top
R24  13.46,34.67 180 top
R25  10.54,20.7 180 top
R26  37.78,30.23 90 top
R27  44.39,15.75 0 top
R28  33.85,24.26 0 top
R29  39.56,20.07 180 top
R30  33.85,26.54 180 top
R31  39.56,15.75 180 top
R32  17.02,30.23 90 top
R33  10.54,16.38 0 top
R34  20.95,24.26 180 top
R35  5.71,20.7 180 top
R36  20.95,26.54 0 top
R37  5.71,16.38 180 top
R38  38.35,2.79 270 top
R39  38.48,9.65 270 top
U1  22.73,71.37 270 top
U$1  51.05,7.62 180 top
VR1  4.7,49.15 0 top
VR2  46.35,56.26 90 top
Y1  35.81,47.43 270 top
Y2  31.62,51.31 180 top
Y3  39.88,64.64 270 top

### Tracks (layer width: path | path; a pad name or v marks a point on that pad's centre or on a via)
1V  (via drill 0.35)  (1 unrouted)
  Top 0.254: 45.7,58.58 C10.1 | IC1.39 IC1.40 IC1.41 | IC1.9 30.48,69.73 J7.1 | IC1.31 24.18,59.87 23.86,59.55 C15.1
  Top 0.305: IC1.10 IC1.9 | 29.97,68.81 IC1.10 | 26.1,61.78 26.02,61.87 IC1.27 | 26.1,61.78 26.29,61.59 v26.29,60.83 26.29,60.33 25.83,59.87 IC1.31 | IC1.59 35.41,64.37 35.31,64.26 35.31,62.99 | 35.31,62.99 35.43,62.87 35.44,62.87 IC1.56 | 35.31,61.09 35.31,62.99 | 35.31,61.09 35.52,60.87 IC1.52 37.85,60.87 R4.2 39.12,59.31 | v29.99,58.69 IC1.39 | v35.31,58.8 35.31,61.09 | IC1.20 v26.2,65.37 26.2,61.89 26.1,61.78 | IC1.10 29.98,67.75 v29.97,67.74 | 45.15,57.21 VR2.5
  Top 0.4: R4.2 40.3,58.42 45.1,58.42 C10.1
  Top 0.406: 45.51,61.59 45.51,58.83 C10.1 | VR2.5 45.7,58.58
  Bottom 0.305: 29.97,58.67 v29.99,58.69 | v26.2,65.37 28.52,67.69 29.97,67.69 v29.97,67.74
  Bottom 0.4: v26.29,60.83 28.43,58.69 v29.99,58.69 35.2,58.69 v35.31,58.8
3.3V  (25 unrouted)
  Top 0.254: VR1.5 7.42,50.1 C5.1
5V  (via drill 0.35)  (27 unrouted)
  Top 0.254: VR2.1 45.7,54.34 v45.09,53.72
AUDIO_LEFT
  Top 0.305: R28.1 31.24,24.26 C39.1
  Top 0.406: C39.1 31.05,21.94 IC9.1 | R38.1 40.38,3.34 U$1.5
  Bottom 0.4: 40.2,3.02 U$1.5 | 40.7,3.27 U$1.5 | U$1.5 40.7,7.3 37.26,10.74 37.26,15.73 IC9.1
  Bottom 0.406: U$1.5 40.34,3.02
AUDIO_RIGHT
  Top 0.4: R39.1 32.31,10.2 IC9.7 | 21.8,20.71 R34.1 23.56,24.26 C42.1
  Top 0.406: R39.1 38.48,11.43 38.77,11.72 U$1.2 | 21.8,20.71 IC9.7
BCK
  Top 0.254: IC1.4 32.98,67.91 32.16,67.08 28.09,67.08 26.95,65.94 26.95,60.24 22.23,55.52 R17.1
CLK
  Top 0.305: IC1.58 Y3.3
D0  (1 unrouted)
  Top 0.254: 20.76,74.1 20.99,73.88 | 20.99,73.88 25.4,69.47 | J14.1 5.21,69.47 10.04,74.3 20.57,74.3 20.99,73.88
  Top 0.305: IC1.15 27.48,69.54 27.4,69.62 25.69,69.62 U1.5
D1
  Top 0.254: IC1.17 24.56,66.87 20.83,70.61 20.83,71.5 20.32,72.01 U1.2 14.71,72.01 J15.1
D2
  Top 0.254: IC1.18 24.49,66.37 20.12,70.74 U1.3 16.74,70.74 J16.1
D3  (via drill 0.35)
  Top 0.305: v26.42,66.55 25.74,65.87 IC1.19 | U1.7 26.92,72.01 J17.1
  Bottom 0.305: v26.42,66.55 26.42,71.5 J17.1
DAC_RST  (1 unrouted)
  Top 0.254: J18.1 14.82,43.5 16.33,45 16.33,48.04 16.49,48.2 18.22,48.2 18.39,48.03 IC6.14
DATA
  Top 0.254: R16.1 24.26,56.72 27.61,60.07 27.61,65.64 28.38,66.42 32.51,66.42 33.98,67.89 IC1.2
DM_I
  Top 0.305: IC2.3 arc90 16.13,61.36 16.13,59.69 arc-90 15.62,59.18 arc-90 14.62,60.19 J1.D-
DP_I
  Top 0.406: J1.D+ 15.32,62.99 IC2.2
GND  (3 unrouted)
  Top 0.254: VR2.2 46.35,57.93 C10.2
  pour Route2: 0.25,94.74 63.12,94.74 63.12,0.38 0.25,0.38
  pour Top: 0.76,0.51 54.1,0.51 54.1,78.87 0.76,78.87
GPI_3
  Top 0.2: IC1.49 36.43,55.9 GPI.1
GPI_4
  Top 0.2: IC1.50 36.97,59.87 37.34,59.5 37.34,57.98 39.24,56.07 GPI.2
GPI_5
  Top 0.2: IC1.51 36.47,60.34 37,60.34 37.69,59.65 37.69,59.15 40.23,56.61 40.39,56.45 40.96,56.45 GPI.3
IL+  (via drill 0.2 pad 0.15)
  Top 0.2: IC6.25 v24.89,39.88
  Top 0.305: C35.2 43.54,17.88 R23.2 43.54,22.41 IC7.6
  Bottom 0.406: IC7.6 44.39,24.1 44.39,31.24 35.75,39.88 v24.89,39.88
IL+V
  Top 0.305: IC7.7 45.24,22.41 R23.1 45.24,17.88 C35.1 45.34,15.85 R27.2
IL-
  Top 0.305: 45.99,35.01 45.95,34.97 R22.2 | C34.2 45.85,36.58
  Top 0.4: C34.2 45.99,36.69 45.99,35.01 | R22.2 45.95,31.06 IC7.2
  Top 0.406: IC6.26 25.53,38.54 26.67,37.4 45.02,37.4 45.85,36.58
IL-V
  Top 0.4: C34.1 47.75,34.77 R22.1 47.65,31.31 IC7.1 48.17,30.77 46.36,28.96 39.81,28.96 37.78,30.99 R26.2
INPUT_B+
  Top 0.406: C43.1 5.77,17.65 5.77,17.64 5.56,17.44 4.87,16.74 R37.2 7.06,14.19 23.24,14.19 IC9.5
INPUT_B-  (via drill 0.3 pad 0.5)
  Top 0.4: R36.2 23.56,26.54 C42.2 26.29,23.81
  Top 0.406: 26.29,23.81 v26.29,23.18
  Bottom 0.406: v26.29,23.18 25.78,22.67 24.96,21.84 24.96,14.92 24.99,14.92 26.1,13.81 IC9.6
IR+
  Top 0.406: C37.2 9.69,18.64 R25.2 9.69,22.41 IC8.6 10.29,23.84 10.29,37.21 14.35,41.27 19.18,41.27 19.68,40.77 IC6.17
IR+V
  Top 0.406: IC8.7 11.39,22.41 R25.1 11.39,18.64 C37.1 11.49,16.48 R33.2
IR-
  Top 0.4: 16.76,38.35 14.04,38.35 C36.2 12.51,34.77 R24.2 12.61,31.57 IC8.2
  Top 0.406: IC6.18 20.32,38.73 19.94,38.35 16.76,38.35
IR-V
  Top 0.4: C36.1 14.41,34.77 R24.1 14.31,31.03 14.46,30.88 IC8.1 16.71,30.77 R32.2
LRCK
  Top 0.254: R15.1 26.29,57.92 28.14,59.77 28.14,65.32 28.67,65.85 32.07,65.85 32.77,65.85 34.48,67.56 34.48,67.62 34.48,67.94 IC1.1
MCLK
  Top 0.254: 33.44,46.66 31.81,48.28 R11.2 31.62,51.36 Y2.3 31.59,52.88 32.61,52.88 35.04,55.31 35.04,58.03 34.46,58.62 34.46,65.7 35.63,66.87 IC1.64 36.77,66.87 37.47,67.56 J8.1
  Top 0.305: Y1.3 33.44,46.66
MCLK_SEL  (via drill 0.35)
  Top 0.254: IC5.2 36.45,51.31 35.94,50.8 35.94,48.91 Y1.1 37.64,48.21 38.61,47.24 J9.1 | IC1.38 29.48,56.66 29.46,56.64 v29.46,56.39
  Bottom 0.254: v29.46,56.39 38.61,47.24 J9.1
N$2  (1 unrouted)
  Top 0.61: L1.1 13.18,50 C1.1 13.21,55.63 14.62,57.03 J1.VBUS
N$4
  Top 0.406: IC3.5 C12.1
N$5
  Top 0.406: IC3.3 49.06,61.52 R2.2 47.55,61.56 R1.1
N$6
  Top 0.254: R3.2 23.28,63.37 IC1.24
N$7
  Top 0.305: C13.1 40.74,61.3 R4.1 39.05,61.37 IC1.53
N$8  (1 unrouted)
  Top 0.254: 47.16,52.49 R5.1
  Top 0.4: IC4.1 46.62,49.16 47.24,49.78 47.24,52.41
  Top 0.406: VR2.3 47.01,52.65 47.16,52.49
N$13
  Top 0.254: LED1.A 35.93,73.9 35.29,73.27 35.29,67.56 33.67,65.93 33.67,61.26 32.29,59.88 30.25,59.88 28.48,58.12 IC1.36
N$14
  Top 0.254: LED1.C 36.48,72.43 R6.2
N$16  (via drill 0.35)
  Top 0.305: IC6.1 26.82,45.95 27.18,45.59 v27.43,45.34 | v32.64,44.01 32.74,44.01 R9.2
  Bottom 0.305: v27.43,45.34 31.3,45.34 v32.64,44.01
N$18
  Top 0.254: IC6.7 22.94,46.27 24.77,44.43 27.58,44.43 29.73,46.58 R11.1
N$19  (via drill 0.35)
  Top 0.305: IC6.2 26.19,45.7 26.54,45.34 v26.44,45.34 | R10.2 30.74,44.03 v30.61,44.03
  Bottom 0.305: v26.44,45.34 26.44,44.95 26.95,44.43 30.21,44.43 v30.61,44.03
N$20  (via drill 0.35)
  Top 0.305: R12.2 29.59,44.77 v28.26,43.43 | v25.53,45.34 IC6.3
  Bottom 0.305: 25.53,45.21 v25.53,45.34 25.53,44.45 26.54,43.43 v28.26,43.43
N$21
  Top 0.305: IC6.20 21.64,37.35 R14.2
N$22
  Top 0.305: IC6.4 24.89,47.88 24.89,48.17 R15.2
N$23
  Top 0.305: R17.2 23.57,48.22 IC6.6
N$24
  Top 0.305: R16.2 24.23,49.54 IC6.5
N$25
  Top 0.254: 51.05,64.69 50.98,64.77 R18.1 50.51,67.75 JP1.2
  Top 0.4: IC3.1 51.97,63.78 51.05,64.69
N$29
  Top 0.4: 50.65,58.93 50.42,58.7 50.42,53.85 JP4.1
  Top 0.406: 50.65,58.93 IC3.4
N$30
  Top 0.305: IC6.22 IC6.23
  Top 0.4: 24.64,35.69 C24.-
  Top 0.406: 23.57,37.97 IC6.23 23.66,39.71 23.66,38.83 27.27,35.22 C27.- | 23.57,37.97 23.57,37.77 | C24.- 24.64,36.34 24.65,36.35 24.65,36.64 23.57,37.72 23.57,37.97
N$35
  Top 0.305: R20.1 11.81,1.44 IC10.3
  Top 0.406: R21.2 R20.1
N$39
  Top 0.305: R28.2 R30.1
  Top 0.4: R26.1 37.78,26.92 37.91,26.8 C38.1
  Top 0.406: R30.1 37.15,26.54 C38.1
N$40
  Top 0.4: R27.1 43.19,15.75 41.92,17.02 41.88,17.06 40.7,15.88 40.7,15.75 | 41.92,21.59 41.92,21.07 40.92,20.07 R29.1
  Top 0.406: R31.1 40.7,15.75 | 41.92,17.02 41.92,21.59 41.92,22.86 40.78,24 C38.2
N$41
  Top 0.406: C40.1 40.51,17.53 38.73,15.75 R31.2 34.35,15.75 29.37,20.73 27.18,20.73 IC9.3
N$42
  Top 0.305: R30.2 31.24,26.54 C39.2
  Top 0.406: C39.2 29.84,26.35 28.64,25.15 28.64,21.81 IC9.2
N$45
  Top 0.4: R34.2 R36.1 19.85,26.8 C41.1 17.27,26.8 17.02,26.54 R32.1
N$46
  Top 0.4: 12.83,20.19 16.63,24
  Top 0.406: R37.1 8.13,17.95 | R35.1 6.73,20.7 8.13,19.3 8.13,17.95 | 12.83,20.19 12.83,15.49 12.32,14.99 10.92,14.99 9.69,16.22 R33.1 8.13,17.95 | 16.63,24 C41.2
N_MCLK_SEL  (1 unrouted)
  Top 0.254: 41.78,51.18 39.62,53.34 36.7,53.34 35.62,52.26 IC5.4 34.17,52.26 Y2.1
RST_N  (via drill 0.35)
  Top 0.305: IC1.57 37.09,63.37 v37.47,62.99 | v44.96,62.99 45.43,62.99 R19.1
  Bottom 0.4: v37.47,62.99 v44.96,62.99 49.4,58.55 JP4.2
SCLK
  Top 0.254: R8.1 17.11,46.39 17.78,45.72 19.56,45.72 19.68,45.85 IC6.12
  Top 0.305: IC1.29 23.91,60.87 20.45,57.4 19.68,56.64 IC6.12
SDATA
  Top 0.254: IC1.28 23.27,61.37 19.02,57.12 19.02,50.1 | 19.02,50.1 19.02,49.53 IC6.13 | R7.1 18.45,49.53 19.02,50.1
SPI_CLK  (1 unrouted)
  Top 0.152: 28.96,68.84 IC1.12
  Top 0.305: U1.6 27.64,70.74 28.98,69.4 28.98,68.96 | IC1.12 28.98,68.96 | J13.1 28.98,71.02 28.98,68.96
SPI_CS
  Top 0.254: IC1.11 29.48,68.22 28.96,67.69 25.78,67.69 20.19,73.28 19.81,73.28 | 8.38,70.25 8.38,69.91 | 8.38,69.91 J12.1 | U1.1 14.86,73.28 13.59,72.01 9.84,72.01 9.53,71.69 | 9.53,71.69 8.38,70.55 8.38,69.91 | 9.53,71.69 10.86,73.03 R13.2
  Top 0.305: 19.81,73.28 U1.1
  Top 0.4: 19.81,73.28 20.19,73.28
USBDM
  Top 0.254: IC1.26 20.08,62.37 19.75,62.04 IC2.4
USBDP
  Top 0.254: IC1.25 19.63,62.87 IC2.5
VGND
  Top 0.406: IC10.6 9.27,8.92 IC10.2 9.27,3.68 7.43,5.52 4.83,5.52 J19.1 | IC7.5 38.71,20.96 R29.2 38.71,17.88 C40.2 | C43.2 4.87,18.64 R35.2 4.87,20.96 IC8.5
  Bottom 0.4: IC8.5 7.91,24 | 7.91,24 8.13,24 | 7.91,24 9.27,25.37 9.27,25.78
  Bottom 0.406: IC8.3 9.27,25.78 | IC8.5 6.73,17.02 6.73,16.54 IC10.6 | 9.27,3.3 IC10.2 | IC7.3 43.12,25.37 IC7.5 39.4,24 8.13,24